# Altium schematic sheet 02_Power.SchDoc: Power
size 558 x 431 mm; SheetNumber: 2; SheetTotal: 11
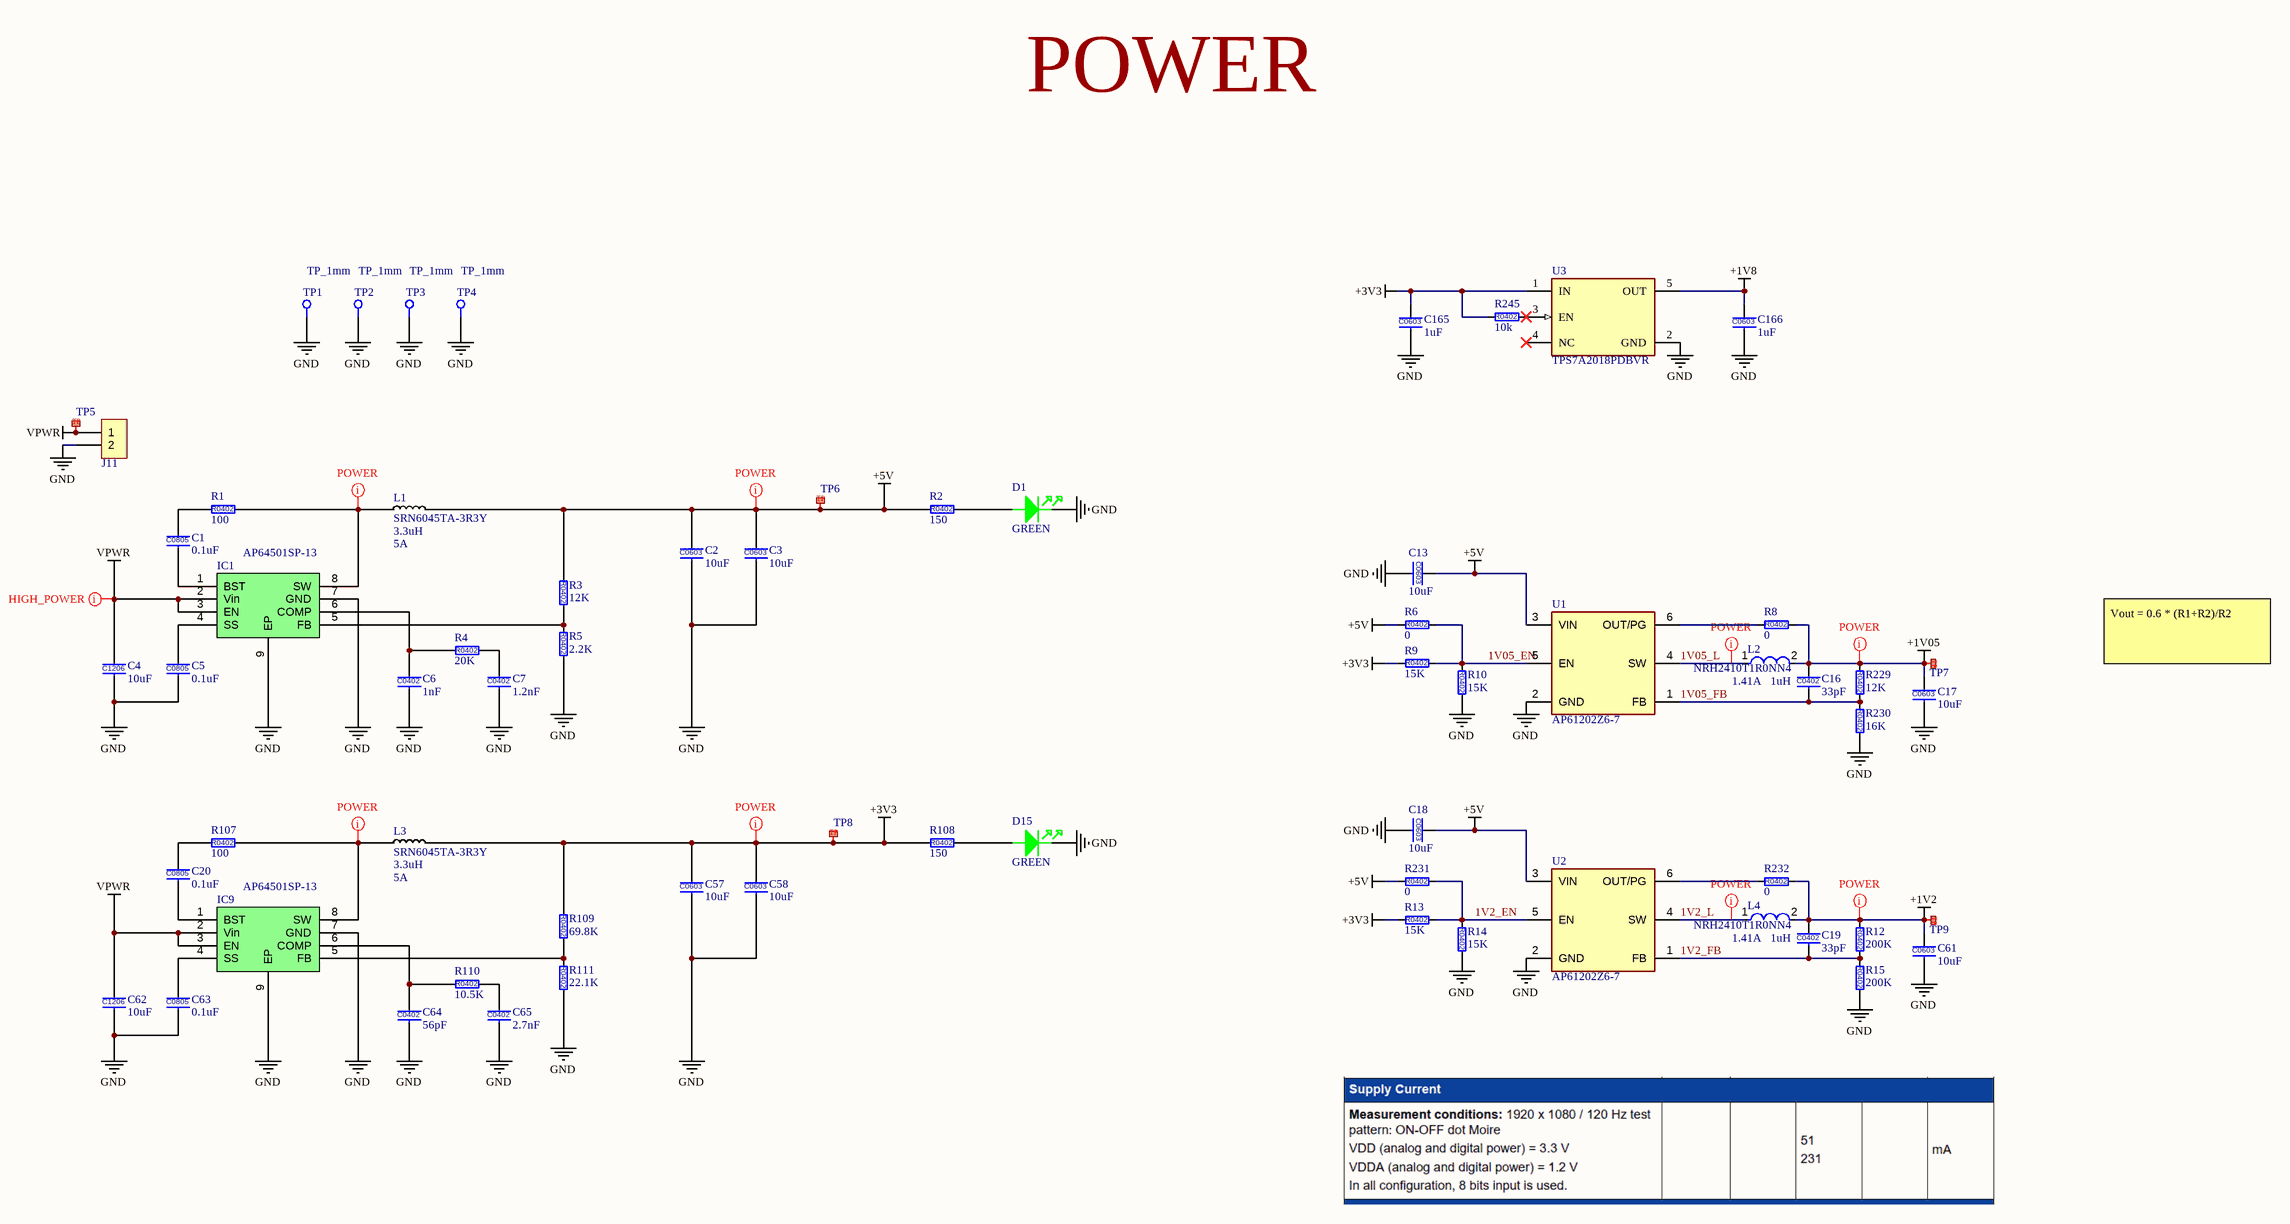
[diagram p0: 02_Power.SchDoc]

## Parts
C1  0.1uF  [C0805]
C2  10uF  [C0603]
C3  10uF  [C0603]
C4  10uF  [C1206]
C5  0.1uF  [C0805]
C6  1nF  [C0402]
C7  1.2nF  [C0402]
C13  10uF  [C0603]
C16  33pF  [C0402]
C17  10uF  [C0603]
C18  10uF  [C0603]
C19  33pF  [C0402]
C20  0.1uF  [C0805]
C57  10uF  [C0603]
C58  10uF  [C0603]
C61  10uF  [C0603]
C62  10uF  [C1206]
C63  0.1uF  [C0805]
C64  56pF  [C0402]
C65  2.7nF  [C0402]
C165  1uF  [C0603]
C166  1uF  [C0603]
D1  GREEN  [LED_0603]
D15  GREEN  [LED_0603]
IC1  AP64501SP-13  [AP64501SP-13_SOIC_8]
IC9  AP64501SP-13  [AP64501SP-13_SOIC_8]
J11  PLS-2  [PLS-2-3D]  (value not drawn)
L1  SRN6045TA-3R3Y  Inductance: 3.3uH  RMS Current (Irms): 5A  [SRN6045TA]
L2  NRH2410T1R0NN4  value 1uH  Current Rating: 1.41A  [NRH2410]
L3  SRN6045TA-3R3Y  Inductance: 3.3uH  RMS Current (Irms): 5A  [SRN6045TA]
L4  NRH2410T1R0NN4  value 1uH  Current Rating: 1.41A  [NRH2410]
R1  100  [R0402]
R2  150  [R0402]
R3  12K  [R0402]
R4  20K  [R0402]
R5  2.2K  [R0402]
R6  0  [R0402]
R8  0  [R0402]
R9  15K  [R0402]
R10  15K  [R0402]
R12  200K  [R0402]
R13  15K  [R0402]
R14  15K  [R0402]
R15  200K  [R0402]
R107  100  [R0402]
R108  150  [R0402]
R109  69.8K  [R0402]
R110  10.5K  [R0402]
R111  22.1K  [R0402]
R229  12K  [R0402]
R230  16K  [R0402]
R231  0  [R0402]
R232  0  [R0402]
R245  10k  [R0402]
TP1  TP_1mm  [TP_1MM]  (no BOM)
TP2  TP_1mm  [TP_1MM]  (no BOM)
TP3  TP_1mm  [TP_1MM]  (no BOM)
TP4  TP_1mm  [TP_1MM]  (no BOM)
TP5  Testpoint 1mm SMD  [TP_1mm_SMD]  (value not drawn)  (no BOM)
TP6  Testpoint 1mm SMD  [TP_1mm_SMD]  (value not drawn)  (no BOM)
TP7  Testpoint 1mm SMD  [TP_1mm_SMD]  (value not drawn)  (no BOM)
TP8  Testpoint 1mm SMD  [TP_1mm_SMD]  (value not drawn)  (no BOM)
TP9  Testpoint 1mm SMD  [TP_1mm_SMD]  (value not drawn)  (no BOM)
U1  AP61202Z6-7  [AP61202Z6-7_SOT563]
U2  AP61202Z6-7  [AP61202Z6-7_SOT563]
U3  TPS7A2018PDBVR  [TPS7A20_SOT_23_5]

## Nets
+1V2: C19.1 C61.1 L4.2 R12.1 R232.2 TP9.1
+1V05: C16.1 C17.1 L2.2 R8.2 R229.1 TP7.1
+1V8: C166.1 U3.5(OUT)
+3V3: C57.1 C58.1 C165.1 L3.2 R9.1 R13.1 R108.1 R109.1 R245.1 TP8.1 U3.1(IN)
+5V: C2.1 C3.1 C13.1 C18.1 L1.2 R2.1 R3.1 R6.1 R231.1 TP6.1 U1.3(VIN) U2.3(VIN)
GND: C2.2 C3.2 C4.2 C5.2 C6.2 C7.2 C13.2 C17.2 C18.2 C57.2 C58.2 C61.2 C62.2 C63.2 C64.2 C65.2 C165.2 C166.2 D1.1(Cathode) D15.1(Cathode) IC1.7(GND) IC1.9(EP) IC9.7(GND) IC9.9(EP) J11.2 R5.2 R10.2 R14.2 R15.2 R111.2 R230.2 TP1.1 TP2.1 TP3.1 TP4.1 U1.2(GND) U2.2(GND) U3.2(GND)
VPWR: C4.1 C62.1 IC1.2(Vin) IC1.3(EN) IC9.2(Vin) IC9.3(EN) J11.1 TP5.1
1V2_EN: R13.2 R14.1 R231.2 U2.5(EN)
1V2_FB: C19.2 R12.2 R15.1 U2.1(FB)
1V2_L: L4.1 U2.4(SW)
1V05_EN: R6.2 R9.2 R10.1 U1.5(EN)
1V05_FB: C16.2 R229.2 R230.1 U1.1(FB)
1V05_L: L2.1 U1.4(SW)
NetC1_1: C1.1 R1.1
NetC1_2: C1.2 IC1.1(BST)
NetC5_1: C5.1 IC1.4(SS)
NetC6_1: C6.1 IC1.6(COMP) R4.1
NetC7_1: C7.1 R4.2
NetC20_1: C20.1 R107.1
NetC20_2: C20.2 IC9.1(BST)
NetC63_1: C63.1 IC9.4(SS)
NetC64_1: C64.1 IC9.6(COMP) R110.1
NetC65_1: C65.1 R110.2
NetD1_2: D1.2(Anode) R2.2
NetD15_2: D15.2(Anode) R108.2
NetIC1_5: IC1.5(FB) R3.2 R5.1
NetIC1_8: IC1.8(SW) L1.1 R1.2
NetIC9_5: IC9.5(FB) R109.2 R111.1
NetIC9_8: IC9.8(SW) L3.1 R107.2
NetR8_1: R8.1 U1.6(OUT/PG)
NetR232_1: R232.1 U2.6(OUT/PG)
NetR245_2: R245.2 U3.3(EN)

Not connected (* = marked no-connect by the designer): U3 4(NC)*

## Layout directives
net class HIGH_POWER: VPWR
net class POWER: 1V2_L, 1V05_L, +1V2, +1V05, +3V3, +5V, NetIC1_8, NetIC9_8

## Notes on the sheet
- POWER
- Vout = 0.6 * (R1+R2)/R2
- DWG. NO.
- REV.
- SHT.
- REVISION
- DESCRIPTION
- DATE
- APPROVED
- THIS DOCUMENT AND THE DATA DISCLOSED HEREIN OR HEREWITH IS THE PROPERTY OF ALTIUM LIMITED AND MAY BE FREELY DISTRIBUTED IN WHOLE. NO RIGHTS ARE RESERVED OR EXPRESS OR IMPLIED WARANTEE GIVEN.
- ENG:
- DSN:
- APPROVALS
- PROJECT
- DOCUMENT REVISION:
- DESIGN ITEM:
- CHK:
- BOM:
- REFERENCE DOCUMENTS
- PROJECT REVISION:
- TITLE
- FAB DWG:
- PCB DWG:
- ASSY DWG:
- SCALE:
- SIZE
- C
- CAGE CODE
- FILE NAME
- DWG NO.
- SHEET
- OF
- REV
- (in symbol 0201ZD105MAT2A) C0603
- (in symbol 0402ZA560FAT2A) C0402
- (in symbol 0402ZC122JAT2A) C0402
- (in symbol 0402ZC272JAT2A) C0402
- (in symbol 0402ZC330KAT2A) C0402
- (in symbol 0402ZD102KAT2A) C0402
- (in symbol 0603ZD106KAT2A) C0603
- (in symbol 08055D104KAT2A) C0805
- (in symbol 12065D106KAT4A) C1206
- (in symbol CRCW04022K20FK) R0402
- (in symbol CRCW040210K0FK) R0402
- (in symbol CRCW040210K5FKED) R0402
- (in symbol CRCW040212K0FK) R0402
- (in symbol CRCW040215K0FK) R0402
- (in symbol CRCW040216K0FK) R0402
- (in symbol CRCW040220K0FKEDC) R0402
- (in symbol CRCW040222K1FKEDC) R0402
- (in symbol CRCW040269K8FKEDC) R0402
- (in symbol CRCW0402100RFK) R0402
- (in symbol CRCW0402150RFKEDC) R0402
- (in symbol CRCW0402200KFKEDC) R0402
- (in symbol CRCW04020000Z0) R0402
- (in symbol TP_1mm_SMD) TP

## Library data of the parts
C1 C5 C20 C63 = 08055D104KAT2A: CAP CER 0.1uF 10% 50V X5R 0805; Manufacturer: KYOCERA AVX; Value: 0.1µF; check: ok; Manufacturer Part Number: 08055D104KAT2A; Tolerance: ±10%; Voltage - Rated: 50V; Temperature Coefficient: X5R
C2 C3 C13 C17 C18 C57 C58 C61 = 0603ZD106KAT2A: CAP CER 10uF 10% 10V X5R 0603; Manufacturer: KYOCERA AVX; Value: 10µF; Manufacturer Part Number: 0603ZD106KAT2A; Tolerance: ±10%; Voltage - Rated: 10V; Temperature Coefficient: X5R
C4 C62 = 12065D106KAT4A: CAP CER  10uF 10% 50V X5R 1206; Manufacturer: KYOCERA AVX; Value: 10µF; check: ok; Manufacturer Part Number: 12065D106KAT4A; Tolerance: ±10%; Voltage - Rated: 50V; Temperature Coefficient: X5R
C6 = 0402ZD102KAT2A: CAP CER 1nF 10% 10V X5R 0402; Manufacturer: KYOCERA AVX; check: ok; Manufacturer Part Number: 0402ZD102KAT2A; Operating Temperature: -55°C ~ 85°C; Package / Case: 0402 (1005 Metric); Value: 1nF; Voltage - Rated: 10V; Tolerance: ±10%; Temperature Coefficient: X5R
C7 = 0402ZC122JAT2A: CAP CER  1.2nF 10% 10V X7R 0402; Manufacturer: KYOCERA AVX; check: ok; Manufacturer Part Number: 0402ZC122JAT2A; Operating Temperature: -55°C ~ 125°C; Package / Case: 0402 (1005 Metric); Value: 1.2nF; Voltage - Rated: 10V; Tolerance: ±10%; Temperature Coefficient: X7R
C16 C19 = 0402ZC330KAT2A: CAP CER 33pF 10% 10V X7R 0402; Manufacturer: KYOCERA AVX; check: ok; Manufacturer Part Number: 0402ZC330KAT2A; Operating Temperature: -55°C ~ 125°C; Package / Case: 0402 (1005 Metric); Value: 33pF; Voltage - Rated: 10V; Tolerance: ±10%; Temperature Coefficient: X7R
C64 = 0402ZA560FAT2A: CAP CER 56pF 1% 10V NP0 0402; Manufacturer: KYOCERA AVX; check: ok; Manufacturer Part Number: 0402ZA560FAT2A; Operating Temperature: -55°C ~ 125°C; Package / Case: 0402 (1005 Metric); Value: 56pF; Voltage - Rated: 10V; Tolerance: ±1%; Temperature Coefficient: NP0
C65 = 0402ZC272JAT2A: CAP CER  2.7nF 10% 10V X7R 0402; Manufacturer: KYOCERA AVX; check: ok; Manufacturer Part Number: 0402ZC272JAT2A; Operating Temperature: -55°C ~ 125°C; Package / Case: 0402 (1005 Metric); Value: 2.7nF; Voltage - Rated: 10V; Tolerance: ±10%; Temperature Coefficient: X7R
C165 C166 = 0201ZD105MAT2A: CAP CER 1uF 20% 10V X5R 0603; Manufacturer: KYOCERA AVX; Value: 1uF; Tolerance: 20%; Manufacturer Part Number: 0201ZD105MAT2A
D1 D15 = LED_SMD_0603_GREEN: LED Uni-Color Yellow Green 574nm 2-Pin Chip 0603(1608Metric) T/R; Manufacturer: Vishay Semiconductors; Manufacturer Part Number: VLMG1300-GS08; Color: Green,Yellow; Forward Voltage: 2V; Forward Current: 20mA; Lens Style: Rectangular,Clear; Luminous Intensity: 35mcd; Number of LEDs: 1; Viewing Angle: 130°; Dominant Wavelength: 571nm; Power Dissipation: 75mW; Reverse Voltage: 5V; Supplier 1: Farnell; RoHS: Yes; Category: LEDs; Stock 1: 18400; Pricing 1: 5=0.31000, 10=0.23700, 100=0.10900, 500=0.09900 (EUR); Mount: Surface Mount; Case/Package: 0603; Number of Pins: 2; Case Code (Metric): 1608; Case Code (Imperial): 0603; Min Operating Temperature: -35°C; Max Operating Temperature: 85°C; Packaging: Tape and Reel; Package Quantity: 1; Series: CHipLED; Illumination Color: Green,Yellow; Wavelength: 571nm; Test Current: 20mA; Number of Elements: 1; Power Rating: 75mW; Length: 1.6mm; Width: 0.8mm; Height: 0.8mm; Depth: 0.8mm; Radiation Hardening: No; RoHS Compliant: Yes; Lead Free: Lead Free; ComponentLink1URL: https://datasheet.ciiva.com/8028/vlmo1300-8028023.pdf?src-supplier=Element14; ComponentLink1Description: https://datasheet.ciiva.com/8028/vlmo1300-8028023.pdf?src-supplier=Element14; ComponentLink2URL: https://datasheet.ciiva.com/2114/vlmo1300-2114971.pdf?src-supplier=Digi-Key; ComponentLink2Description: https://datasheet.ciiva.com/2114/vlmo1300-2114971.pdf?src-supplier=Digi-Key; ComponentLink3URL: https://datasheet.ciiva.com/26322/vlmo1300-26322139.pdf?src-supplier=Element14; ComponentLink3Description: https://datasheet.ciiva.com/26322/vlmo1300-26322139.pdf?src-supplier=Element14; ComponentLink4URL: https://datasheet.ciiva.com/2114/vlmo1300-2114972.pdf?src-supplier=Digi-Key; ComponentLink4Description: https://datasheet.ciiva.com/2114/vlmo1300-2114972.pdf?src-supplier=Digi-Key; ComponentLink5URL: https://datasheet.ciiva.com/26322/vlmo1300-26322140.pdf?src-supplier=Element14; ComponentLink5Description: https://datasheet.ciiva.com/26322/vlmo1300-26322140.pdf?src-supplier=Element14; ComponentLink6URL: https://datasheet.ciiva.com/2114/vlmo1300-2114973.pdf?src-supplier=Digi-Key; ComponentLink6Description: https://datasheet.ciiva.com/2114/vlmo1300-2114973.pdf?src-supplier=Digi-Key; ComponentLink7URL: https://datasheet.ciiva.com/9333/vlmo1300-9333390.pdf?src-supplier=Avnet; ComponentLink7Description: https://datasheet.ciiva.com/9333/vlmo1300-9333390.pdf?src-supplier=Avnet; Supplier Part Number 1: 2251461
IC1 IC9 = AP64501SP-13: 3.8V to 40V Input 5A Low IQ Synchronous Buck Converter with Programmable Soft-Start Time 8-Pin SOIC EP T/R; Part Number: IC0031; Manufacturer: Diodes; ID: 31; ManfactPart: AP64501SP-13; RefVal: AP64501SP-13; Supplier 1: Mouser; Manufacturer Part Number: AP64501SP-13; RoHS: Yes; Category: Voltage Regulators - Switching; Stock 1: 13842; Pricing 1: 1=2.41000, 10=2.17000, 50=2.05000, 100=1.74000, 1000=1.19000, 10000=1.08000 (USD); Supplier Part Number 1: 621-AP64501SP-13
J11 = PLS-2: Pin Header 2.54MM Pitch Str, 1X2PIN, Full G/f, NY6T, 6.1MM*2.5MM*3.0MM / Bag; Manufacturer: Amphenol; Manufacturer Part Number: G800W306018EU; Supplier 1: Mouser; RoHS: Yes; Category: Connectors; Stock 1: 26660; Pricing 1: 1=0.10000, 10=0.04200, 50=0.04200, 100=0.04000, 1000=0.03500, 10000=0.03000 (USD); Supplier Part Number 1: 523-G800W305018EU; Supplier 2: Mouser; Stock 2: 25697; Pricing 2: 1=0.10000, 10=0.03000, 50=0.03000, 100=0.02900, 1000=0.02600, 10000=0.02100 (USD); Supplier Part Number 2: 523-G800W306018EU
L1 L3 = SRN6045TA-3R3Y: Ind Power Semi-Shielded Wirewound 3.3uH ±30% 1MHz 15 Q-Factor Ferrite 5A T/R; Part Number: IN0005; Manufacturer: Bourns; ID: 5; Saturation Current: 7.8A; DC Resistance (DCR): 21mR; Self Resonant Frequency: 45MHz; RefVal: 3.3µH 5A; ManfactPart: SRN6045TA-3R3Y; Supplier 1: Digi-Key; Manufacturer Part Number: SRN6045TA-3R3Y; RoHS: Yes; Category: Fixed Inductors; Stock 1: 5211; Pricing 1: 1=0.64000, 10=0.55900, 25=0.51920, 50=0.43920, 100=0.39930, 250=0.37532, 500=0.33538 (USD); Mount: Surface Mount; Case/Package: Nonstandard; Core Material: Ferrite; Min Operating Temperature: -55°C; Max Operating Temperature: 125°C; Packaging: Cut Tape; Inductance Tolerance: 30%; Series: SRN6045TA; Tolerance: 30%; Shielding: Shielded; Test Frequency: 1MHz; Ratings: AEC-Q200; Reach SVHC Compliant: Yes; RoHS Compliant: Yes; ComponentLink1URL: http://www.farnell.com/datasheets/2647414.pdf?src-supplier=Farnell; ComponentLink1Description: http://www.farnell.com/datasheets/2647414.pdf?src-supplier=Farnell; ComponentLink2URL: http://www.farnell.com/datasheets/2113223.pdf?src-supplier=Element14; ComponentLink2Description: http://www.farnell.com/datasheets/2113223.pdf?src-supplier=Element14; ComponentLink3URL: https://www.bourns.com/docs/Product-Datasheets/SRN6045TA.pdf?src-supplier=Digi-Key; ComponentLink3Description: https://www.bourns.com/docs/Product-Datasheets/SRN6045TA.pdf?src-supplier=Digi-Key; ComponentLink4URL: http://www.farnell.com/datasheets/2647414.pdf?src-supplier=Newark; ComponentLink4Description: http://www.farnell.com/datasheets/2647414.pdf?src-supplier=Newark; Supplier Part Number 1: SRN6045TA-3R3YCT-ND
L2 L4 = NRH2410T1R0NN4: Inductor Power Shielded Wirewound 1uH 30% 100KHz Ferrite 1.41A 0.084Ohm DCR T/R; Manufacturer: Taiyo Yuden; Saturation Current: 1.8A; DC Resistance (DCR): 84mR; Self Resonant Frequency: 106MHz; Height: 1mm; Series: NRH; Case/Package: 2410; Test Frequency: 100kHz; Halogen Free: Halogen Free; Number of Pins: 2; Termination: SMD/SMT; Tolerance: 30%; Inductance: 1uH; Package Quantity: 1; Radiation Hardening: No; Width: 0.094inch; Min Operating Temperature: -25°C; Max DC Current: 1.8A; Shielding: Shielded; Mount: Surface Mount; Max Operating Temperature: 120°C; RoHS Compliant: Yes; Core Material: Ferrite; Depth: 2.5mm; Packaging: Tape and Reel; Length: 2.4mm; Supplier 1: Digi-Key; Manufacturer Part Number: NRH2410T1R0NN4; RoHS: Yes; Category: Fixed Inductors; Stock 1: 1576; Pricing 1: 1=0.21000, 10=0.18900, 25=0.16760, 50=0.14260, 100=0.12570, 250=0.11528, 500=0.10478, 1000=0.08802 (USD); Mounting Technology: Surface Mount; Pins: 2; ComponentLink1URL: https://datasheet.ciiva.com/8502/nrh2410t1r0nn4-ss-8502790.pdf?src-supplier=Avnet; ComponentLink1Description: https://datasheet.ciiva.com/8502/nrh2410t1r0nn4-ss-8502790.pdf?src-supplier=Avnet; ComponentLink2URL: https://datasheet.ciiva.com/1065/nrh2410t1r0nn4-ss-1065600.pdf?src-supplier=Digi-Key; ComponentLink2Description: https://datasheet.ciiva.com/1065/nrh2410t1r0nn4-ss-1065600.pdf?src-supplier=Digi-Key; ComponentLink3URL: https://datasheet.ciiva.com/25607/0900766b810b3cd2-25607923.pdf?src-supplier=RSComponents; ComponentLink3Description: https://datasheet.ciiva.com/25607/0900766b810b3cd2-25607923.pdf?src-supplier=RSComponents; ComponentLink4URL: https://datasheet.ciiva.com/23806/1749893-23806709.pdf?src-supplier=Newark; ComponentLink4Description: https://datasheet.ciiva.com/23806/1749893-23806709.pdf?src-supplier=Newark; Supplier Part Number 1: 587-2385-1-ND
R1 R107 = CRCW0402100RFK: RES SMD 100 ohm 1% 1/16W R0402; Manufacturer: Vishay; check: ok; Manufacturer Part Number: CRCW0402100RFK; Value: 100; Power (Watts): 1/16W; Package / Case: 0402; Tolerance: ±1%
R2 R108 = CRCW0402150RFKEDC: RES SMD 150 ohm 1% 1/16W R0402; Manufacturer: Vishay Dale; check: ok; Manufacturer Part Number: CRCW0402150RFKEDC; Value: 150; Power (Watts): 1/16W; Package / Case: 0402; Tolerance: ±1%
R3 = CRCW040212K0FK: RES SMD 12K ohm 1% 1/16W R0402; Manufacturer: Vishay; check: ok; Manufacturer Part Number: CRCW040212K0FK; Value: 12K; Power (Watts): 1/16W; Package / Case: 0402; Tolerance: ±1%
R4 = CRCW040220K0FKEDC: RES SMD 20K ohm 1% 1/16W R0402; Manufacturer: Vishay Dale; check: ok; Manufacturer Part Number: CRCW040220K0FKEDC; Value: 20K; Power (Watts): 1/16W; Package / Case: 0402; Tolerance: ±1%
R5 = CRCW04022K20FK: RES SMD 2.2K ohm 1% 1/16W R0402; Manufacturer: Vishay; check: ok; Manufacturer Part Number: CRCW04022K20FK; Value: 2.2K; Power (Watts): 1/16W; Package / Case: 0402; Tolerance: ±1%
R6 R8 R231 R232 = CRCW04020000Z0: RES SMD 0 ohm 1/16W R0402; Manufacturer: Vishay Dale; check: ok; Manufacturer Part Number: CRCW04020000Z0; Value: 0; Power (Watts): 1/16W; Package / Case: 0402
R9 R10 R13 R14 = CRCW040215K0FK: RES SMD 15K ohm 1% 1/16W R0402; Manufacturer: Vishay Dale; Manufacturer Part Number: CRCW040215K0FK; Value: 15K; Power (Watts): 1/16W; Package / Case: 0402; Tolerance: ±1%
R12 R15 = CRCW0402200KFKEDC: RES SMD 200K ohm 1% 1/16W R0402; Manufacturer: Vishay; check: ok; Manufacturer Part Number: CRCW0402200KFKEDC; Value: 200K; Power (Watts): 1/16W; Package / Case: 0402; Tolerance: ±1%
R109 = CRCW040269K8FKEDC: RES SMD 69.8K ohm 1% 1/16W R0402; Manufacturer: Vishay Dale; check: ok; Manufacturer Part Number: CRCW040269K8FKEDC; Value: 69.8K; Power (Watts): 1/16W; Package / Case: 0402; Tolerance: ±1%
R110 = CRCW040210K5FKED: RES SMD 10.5K ohm 1% 1/16W R0402; Manufacturer: Vishay; check: ok; Manufacturer Part Number: CRCW040210K5FKED; Value: 10.5K; Power (Watts): 1/16W; Package / Case: 0402; Tolerance: ±1%
R111 = CRCW040222K1FKEDC: RES SMD 22.1K ohm 1% 1/16W R0402; Manufacturer: Vishay Dale; check: ok; Manufacturer Part Number: CRCW040222K1FKEDC; Value: 22.1K; Power (Watts): 1/16W; Package / Case: 0402; Tolerance: ±1%
R229 = CRCW040212K0FK: RES SMD 12K ohm 1% 1/16W R0402; Manufacturer: Vishay Dale; Manufacturer Part Number: CRCW040212K0FK; Value: 12K; Power (Watts): 1/16W; Package / Case: 0805 (2012 Metric); Tolerance: ±1%
R230 = CRCW040216K0FK: RES SMD 16K ohm 1% 1/16W R0402; Manufacturer: Vishay Dale; Manufacturer Part Number: CRCW040216K0FK; Value: 16K; Power (Watts): 1/16W; Package / Case: 0402; Tolerance: ±1%
R245 = CRCW040210K0FK: RES SMD 10K ohm 1% 1/16W R0402; Manufacturer: Vishay; check: ok; Manufacturer Part Number: CRCW040210K0FK; Value: 10K; Power (Watts): 1/16W; Package / Case: 0402; Tolerance: ±1%
TP1-TP4 = TP_1mm: Testpoint 1mm; Manufacturer Part Number: General Test Point
TP5-TP9 = TP_1mm_SMD
U1 U2 = AP61202Z6-7: Switching Voltage Regulators DCDC Conv LV Buck SOT563 TR 3K; Manufacturer: Diodes; Supplier 1: Digi-Key; Manufacturer Part Number: AP61202Z6-7; RoHS: No; Stock 1: 2775; Pricing 1: 1=0.45000, 10=0.38600, 25=0.36000, 100=0.28790, 250=0.26732, 500=0.22620, 1000=0.17479 (USD); Supplier Part Number 1: 31-AP61202Z6-7CT-ND
U3 = TPS7A2018PDBVR: IC REG LINEAR 1.8V 300MA SOT23-5; RoHS Compliant: Yes